# EAGLE design LatarMain (EAGLE 9.6.2)

## Sheet 1 of 2: Microcontroller
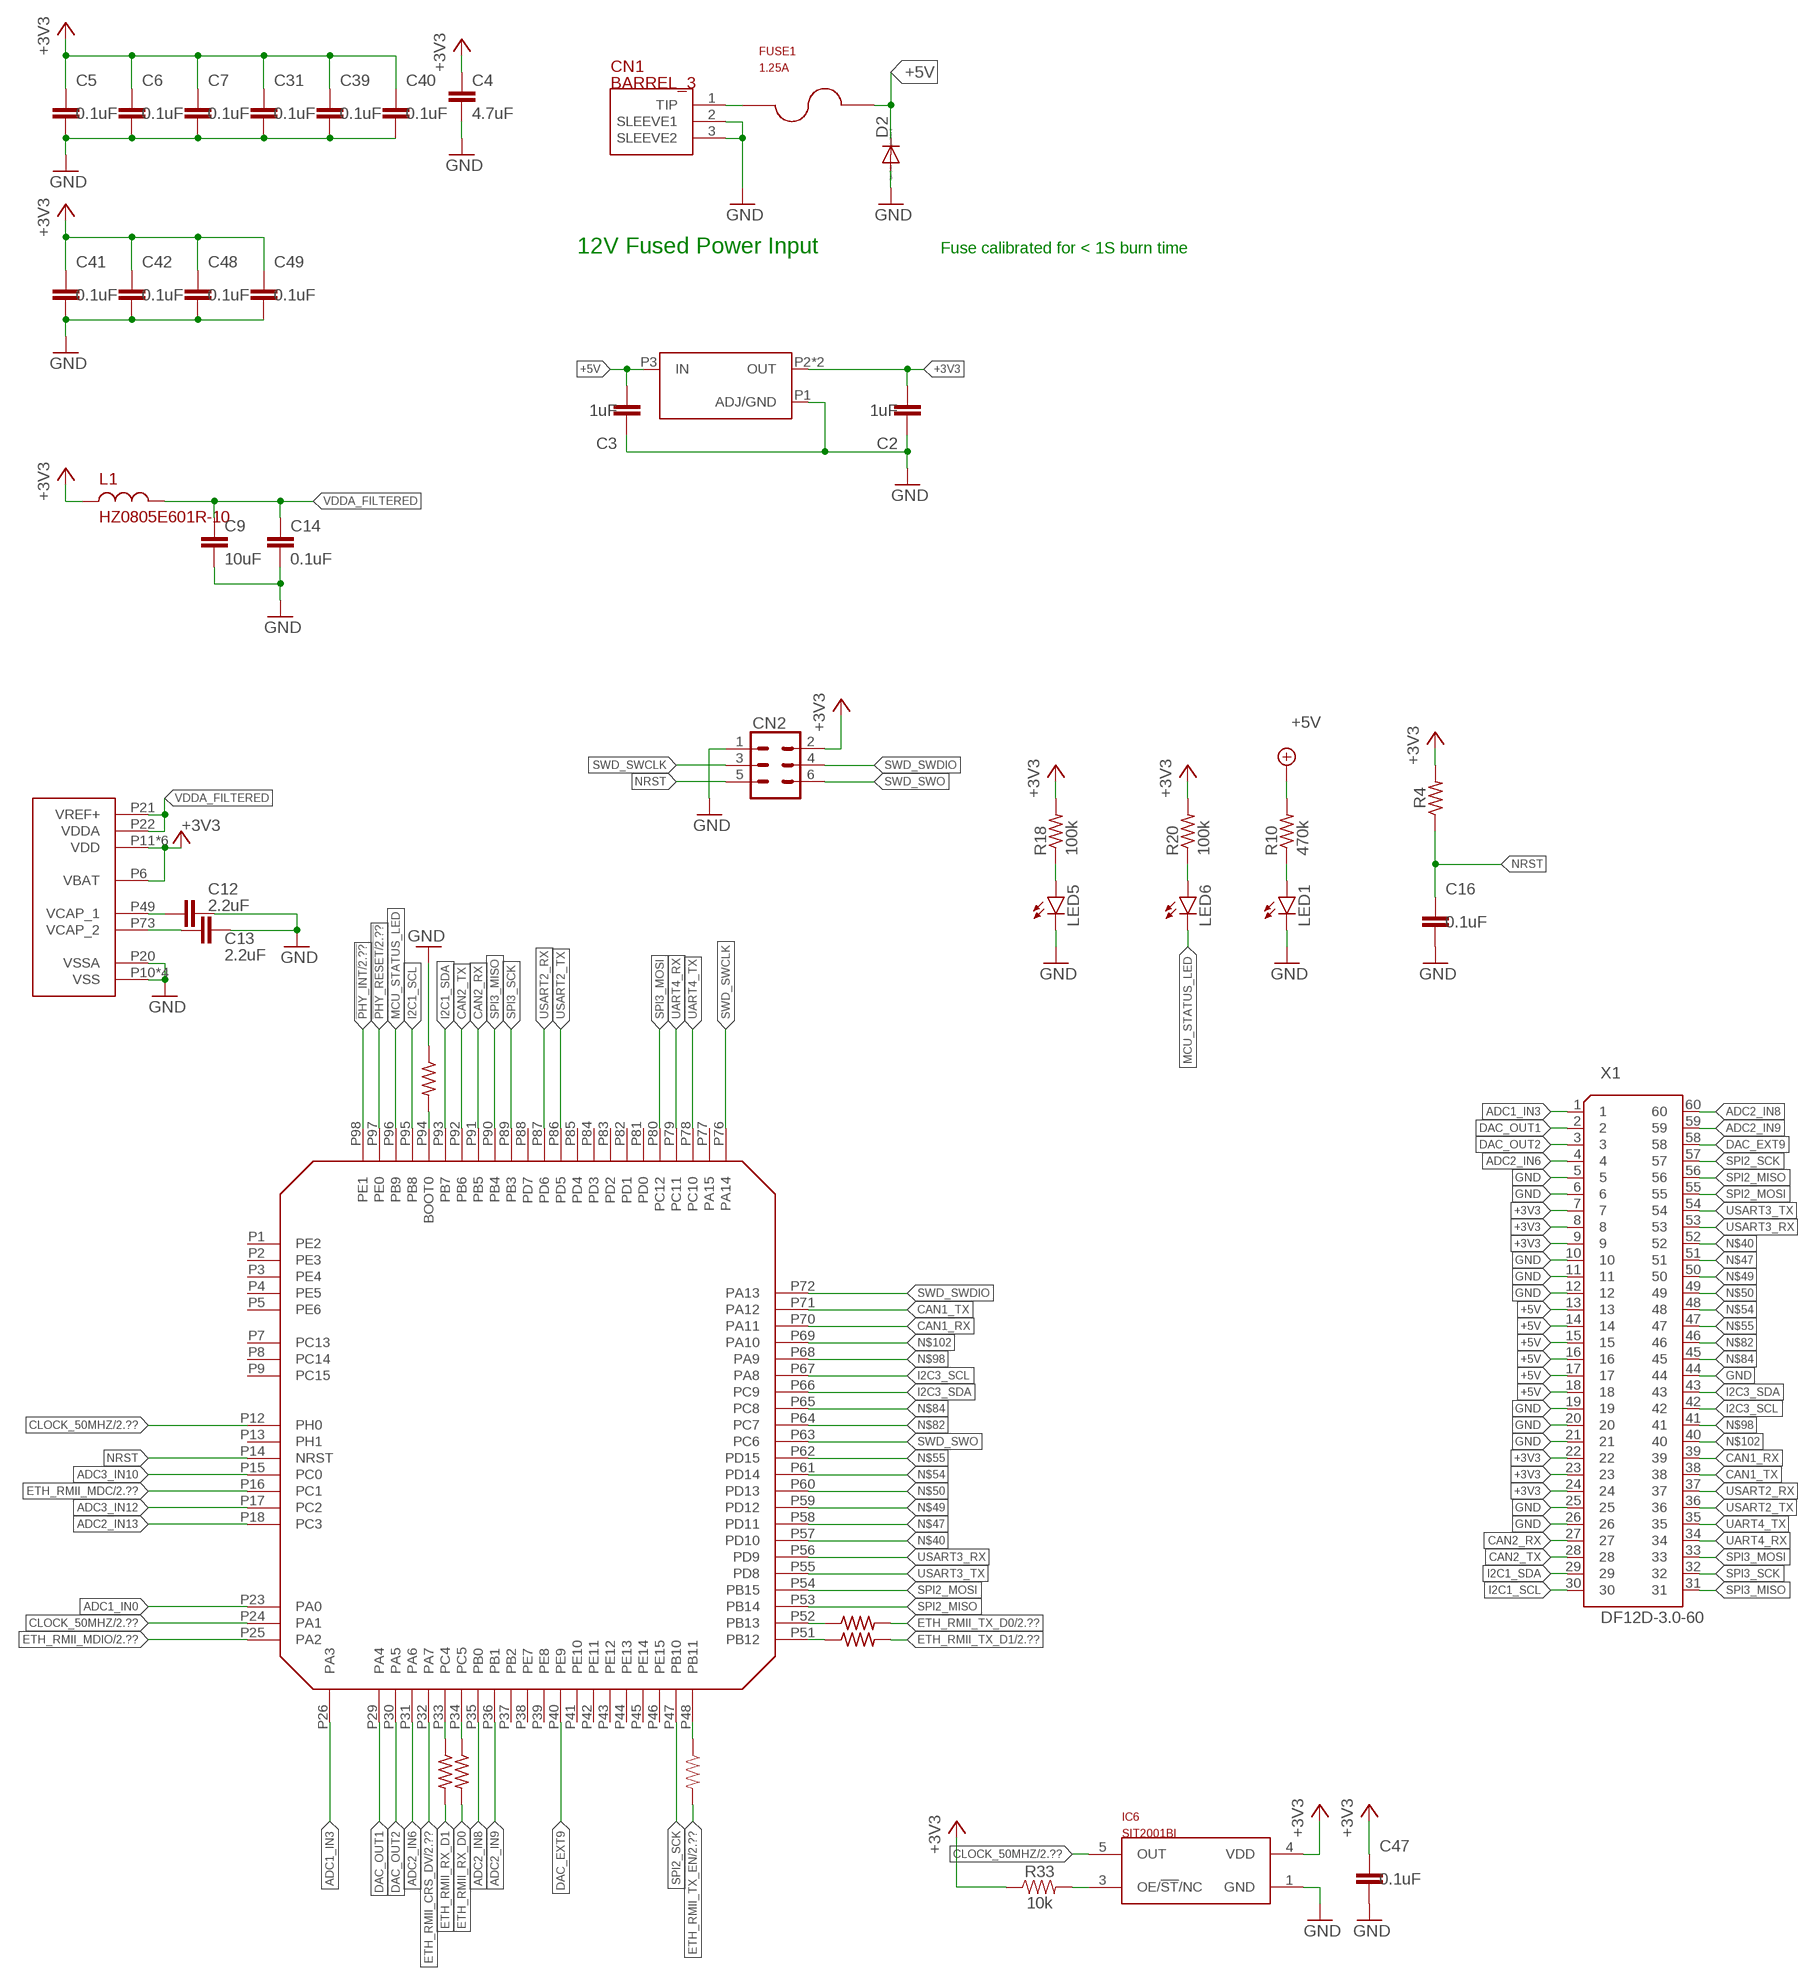
[diagram p0: schematic, sheet 1]

### Parts
C2  1uF  C-EUC1206  [C1206]
C3  1uF  C-EUC1206  [C1206]
C4  4.7uF  C-EUC0805  [C0805]
C5  0.1uF  C-EUC0603  [C0603]
C6  0.1uF  C-EUC0603  [C0603]
C7  0.1uF  C-EUC0603  [C0603]
C9  10uF  C-EUC0805  [C0805]
C12  2.2uF  C-EUC0805  [C0805]
C13  2.2uF  C-EUC0805  [C0805]
C14  0.1uF  C-EUC0805  [C0805]
C16  0.1uF  C-EUC0603  [C0603]
C31  0.1uF  C-EUC0603  [C0603]
C39  0.1uF  C-EUC0603  [C0603]
C40  0.1uF  C-EUC0603  [C0603]
C41  0.1uF  C-EUC0603  [C0603]
C42  0.1uF  C-EUC0603  [C0603]
C47  0.1uF  C-EUC0603  [C0603]
C48  0.1uF  C-EUC0603  [C0603]
C49  0.1uF  C-EUC0603  [C0603]
CN1  BARREL_3  [PJ-002AH]
CN2  CONN_03X22X3_SILK_MALE_PTH  [2X3]
D2  DIODE-DO214AC  [DO214AC]
FUSE1  1.25A  FUSE  [BEL_FUSE_2SMD]
IC6  SIT2001BI  [SOT23-5]
L1  HZ0805E601R-10  [R0805]
LED1  LEDCHIPLED_0603  [CHIPLED_0603]
LED5  LEDCHIPLED_0603  [CHIPLED_0603]
LED6  LEDCHIPLED_0603  [CHIPLED_0603]
R4  10k  R-US_R0805  [R0805]
R10  470k  R-US_R0603  [R0603]
R18  100k  R-US_R0603  [R0603]
R20  100k  R-US_R0603  [R0603]
R32  50k  R-US_R0402  [R0402]
R33  10k  RESISTOR0805  [0805]
R34  10k  R-US_R0805  [R0805]
R39  50k  R-US_R0402  [R0402]
R40  50k  R-US_R0402  [R0402]
R41  50k  R-US_R0402  [R0402]
R42  50k  RESISTOR0603  [0603]
U$1  AZ1117E  [SOT-223]
U$2  STM32_F407_LQFP100  [STM32_LQFP100]
X1  DF12D-3.0-60  [DF12-3.0-60]

### Nets
!PHY_INT: U$2.P98(PE1) ; also sheet 2
!PHY_RESET: U$2.P97(PE0) ; also sheet 2
+3V3: C2.2 C4.1 C5.1 C6.1 C7.1 C31.1 C39.1 C40.1 C41.1 C42.1 C47.1 C48.1 C49.1 CN2.2 IC6.4(VDD) L1.1 R4.2 R18.2 R20.2 R33.1 U$1.P2(OUT) U$1.TAB(OUT) U$2.P6(VBAT) U$2.P11(VDD) U$2.P19(VDD) U$2.P28(VDD) U$2.P50(VDD) U$2.P75(VDD) U$2.P100(VDD) X1.7 X1.8 X1.9 X1.22 X1.23 X1.24 ; also sheet 2
+5V: C3.2 D2.C FUSE1.2 R10.2 U$1.P3(IN) X1.13 X1.14 X1.15 X1.16 X1.17 X1.18
ADC1_IN0: U$2.P23(PA0)
ADC1_IN3: U$2.P26(PA3) X1.1
ADC2_IN6: U$2.P31(PA6) X1.4
ADC2_IN8: U$2.P35(PB0) X1.60
ADC2_IN9: U$2.P36(PB1) X1.59
ADC2_IN13: U$2.P18(PC3)
ADC3_IN10: U$2.P15(PC0)
ADC3_IN12: U$2.P17(PC2)
CAN1_RX: U$2.P70(PA11) X1.39
CAN1_TX: U$2.P71(PA12) X1.38
CAN2_RX: U$2.P91(PB5) X1.27
CAN2_TX: U$2.P92(PB6) X1.28
CLOCK_50MHZ: IC6.5(OUT) U$2.P12(PH0) U$2.P24(PA1) ; also sheet 2
DAC_EXT9: U$2.P40(PE9) X1.58
DAC_OUT1: U$2.P29(PA4) X1.2
DAC_OUT2: U$2.P30(PA5) X1.3
ETH_RMII_CRS_DV: U$2.P32(PA7) ; also sheet 2
ETH_RMII_MDC: U$2.P16(PC1) ; also sheet 2
ETH_RMII_MDIO: U$2.P25(PA2) ; also sheet 2
ETH_RMII_RX_D0: R32.2
ETH_RMII_RX_D1: R39.2
ETH_RMII_TX_D0: R40.2 ; also sheet 2
ETH_RMII_TX_D1: R41.2 ; also sheet 2
ETH_RMII_TX_EN: R42.2 ; also sheet 2
GND: C2.1 C3.1 C4.2 C5.2 C6.2 C7.2 C9.2 C12.2 C13.2 C14.2 C16.2 C31.2 C39.2 C40.2 C41.2 C42.2 C47.2 C48.2 C49.2 CN1.2(SLEEVE1) CN1.3(SLEEVE2) CN2.1 D2.A IC6.1(GND) LED1.C LED5.C R34.1 U$1.P1(ADJ/GND) U$2.P10(VSS) U$2.P20(VSSA) U$2.P27(VSS) U$2.P74(VSS) U$2.P99(VSS) X1.5 X1.6 X1.10 X1.11 X1.12 X1.19 X1.20 X1.21 X1.25 X1.26 X1.44 ; also sheet 2
I2C1_SCL: U$2.P95(PB8) X1.30
I2C1_SDA: U$2.P93(PB7) X1.29
I2C3_SCL: U$2.P67(PA8) X1.42
I2C3_SDA: U$2.P66(PC9) X1.43
MCU_STATUS_LED: LED6.C U$2.P96(PB9)
N$4: R39.1 U$2.P33(PC4)
N$9: C12.1 U$2.P49(VCAP_1)
N$11: C13.1 U$2.P73(VCAP_2)
N$13: R40.1 U$2.P52(PB13)
N$15: LED1.A R10.1
N$18: R34.2 U$2.P94(BOOT0)
N$25: IC6.3(OE/!ST!/NC) R33.2
N$29: CN1.1(TIP) FUSE1.1
N$37: R32.1 U$2.P34(PC5)
N$38: R41.1 U$2.P51(PB12)
N$39: R42.1 U$2.P48(PB11)
N$40: U$2.P57(PD10) X1.52
N$47: U$2.P58(PD11) X1.51
N$48: LED6.A R20.1
N$49: U$2.P59(PD12) X1.50
N$50: U$2.P60(PD13) X1.49
N$54: U$2.P61(PD14) X1.48
N$55: U$2.P62(PD15) X1.47
N$82: U$2.P64(PC7) X1.46
N$84: U$2.P65(PC8) X1.45
N$98: U$2.P68(PA9) X1.41
N$102: U$2.P69(PA10) X1.40
N$104: LED5.A R18.1
NRST: C16.1 CN2.5 R4.1 U$2.P14(NRST)
SPI2_MISO: U$2.P53(PB14) X1.56
SPI2_MOSI: U$2.P54(PB15) X1.55
SPI2_SCK: U$2.P47(PB10) X1.57
SPI3_MISO: U$2.P90(PB4) X1.31
SPI3_MOSI: U$2.P80(PC12) X1.33
SPI3_SCK: U$2.P89(PB3) X1.32
SWD_SWCLK: CN2.3 U$2.P76(PA14)
SWD_SWDIO: CN2.4 U$2.P72(PA13)
SWD_SWO: CN2.6 U$2.P63(PC6)
UART4_RX: U$2.P79(PC11) X1.34
UART4_TX: U$2.P78(PC10) X1.35
USART2_RX: U$2.P87(PD6) X1.37
USART2_TX: U$2.P86(PD5) X1.36
USART3_RX: U$2.P56(PD9) X1.53
USART3_TX: U$2.P55(PD8) X1.54
VDDA_FILTERED: C9.1 C14.1 L1.2 U$2.P21(VREF+) U$2.P22(VDDA)
Unconnected: U$2.P1(PE2) U$2.P2(PE3) U$2.P3(PE4) U$2.P4(PE5) U$2.P5(PE6) U$2.P7(PC13) U$2.P8(PC14) U$2.P9(PC15) U$2.P13(PH1) U$2.P37(PB2) U$2.P38(PE7) U$2.P39(PE8) U$2.P41(PE10) U$2.P42(PE11) U$2.P43(PE12) U$2.P44(PE13) U$2.P45(PE14) U$2.P46(PE15) U$2.P77(PA15) U$2.P81(PD0) U$2.P82(PD1) U$2.P83(PD2) U$2.P84(PD3) U$2.P85(PD4) U$2.P88(PD7)

### Notes on the sheet
- 12V Fused Power Input | Fuse calibrated for < 1S burn time

## Sheet 2 of 2: Ethernet
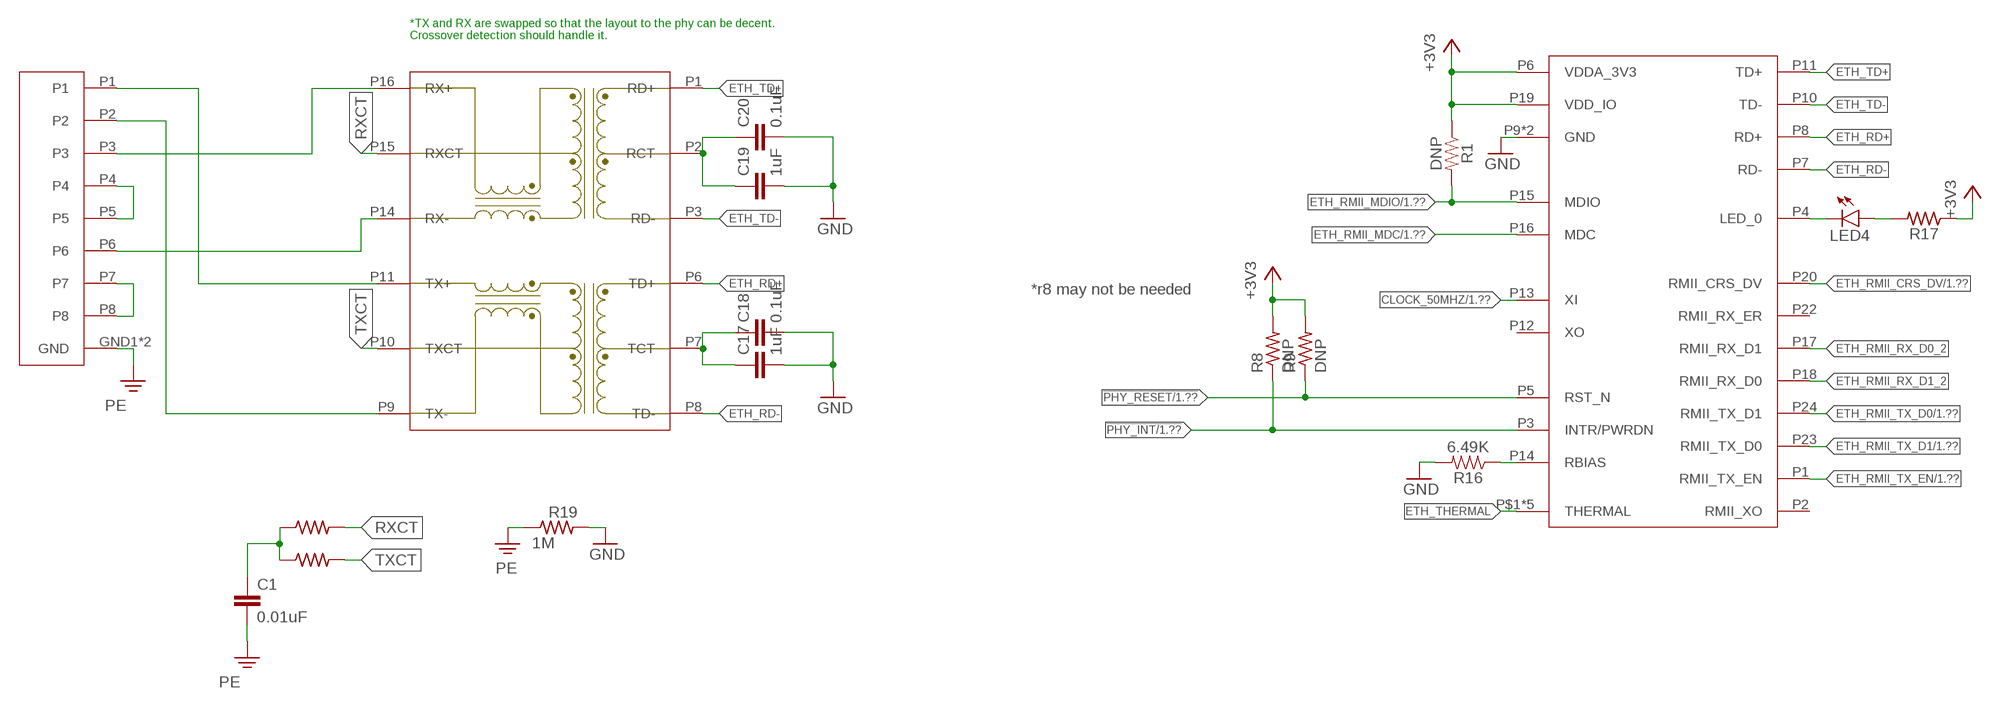
[diagram p1: schematic, sheet 2]

### Parts
C1  0.01uF  C-EUC0805  [C0805]
C17  1uF  C-EUC0805  [C0805]
C18  0.1uF  C-EUC0805  [C0805]
C19  1uF  C-EUC0805  [C0805]
C20  0.1uF  C-EUC0805  [C0805]
LED4  LEDCHIP-LED0603  [CHIP-LED0603]
R1  DNP  RESISTOR0603  [0603]
R2  75R  R-US_R0805  [R0805]
R5  75R  R-US_R0805  [R0805]
R8  DNP  R-US_R0603  [R0603]
R9  DNP  R-US_R0603  [R0603]
R16  6.49K  RESISTOR0603  [0603]
R17  100k  R-US_R0603  [R0603]
R19  1M  R-US_R1206  [R1206]
U$15  749013011  [749013011]
U$16  A120645-ND  [A120645-ND]
U$17  DP83825I  [DP83825I]

### Nets
!PHY_INT: R8.1 U$17.P3(INTR/PWRDN) ; also sheet 1
!PHY_RESET: R9.1 U$17.P5(RST_N) ; also sheet 1
+3V3: R1.1 R8.2 R9.2 R17.1 U$17.P6(VDDA_3V3) U$17.P19(VDD_IO) ; also sheet 1
CLOCK_50MHZ: U$17.P13(XI) ; also sheet 1
ETH_RD+: U$15.P6(TD+) U$17.P8(RD+)
ETH_RD-: U$15.P8(TD-) U$17.P7(RD-)
ETH_RMII_CRS_DV: U$17.P20(RMII_CRS_DV) ; also sheet 1
ETH_RMII_MDC: U$17.P16(MDC) ; also sheet 1
ETH_RMII_MDIO: R1.2 U$17.P15(MDIO) ; also sheet 1
ETH_RMII_RX_D0_2: U$17.P17(RMII_RX_D1)
ETH_RMII_RX_D1_2: U$17.P18(RMII_RX_D0)
ETH_RMII_TX_D0: U$17.P24(RMII_TX_D1) ; also sheet 1
ETH_RMII_TX_D1: U$17.P23(RMII_TX_D0) ; also sheet 1
ETH_RMII_TX_EN: U$17.P1(RMII_TX_EN) ; also sheet 1
ETH_TD+: U$15.P1(RD+) U$17.P11(TD+)
ETH_TD-: U$15.P3(RD-) U$17.P10(TD-)
ETH_THERMAL: U$17.P$1(THERMAL) U$17.P$2(THERMAL) U$17.P$3(THERMAL) U$17.P$4(THERMAL) U$17.PT(THERMAL)
GND: C17.2 C18.2 C19.2 C20.2 R16.2 R19.2 U$17.P9(GND) U$17.P21(GND) ; also sheet 1
GND_EARTH: C1.2 R19.1 U$16.GND1(GND) U$16.GND2(GND) ; supply symbol labelled PE
N$2: LED4.C U$17.P4(LED_0)
N$7: C19.1 C20.1 U$15.P2(RCT)
N$8: C17.1 C18.1 U$15.P7(TCT)
N$10: C1.1 R2.1 R5.1
N$14: U$15.P14(RX-) U$16.P6
N$16: U$15.P9(TX-) U$16.P2
N$23: U$15.P11(TX+) U$16.P1
N$43: U$15.P16(RX+) U$16.P3
N$44: U$16.P4 U$16.P5
N$45: U$16.P7 U$16.P8
N$46: LED4.A R17.2
N$60: R16.1 U$17.P14(RBIAS)
RXCT: R2.2 U$15.P15(RXCT)
TXCT: R5.2 U$15.P10(TXCT)
Unconnected: U$17.P2(RMII_XO) U$17.P12(XO) U$17.P22(RMII_RX_ER)

### Notes on the sheet
- *TX and RX are swapped so that the layout to the phy can be decent.
  Crossover detection should handle it.
- *r8 may not be needed

## Library data of the parts
C1-C7 C9 C12-C14 C16-C20 C31 C39-C42 C47-C49 = rcl:C-EU: CAPACITOR, European symbol; SPICEPREFIX: C
CN1 = HappyMedium:BARREL_3
CN2 = SparkFun-Connectors:CONN_03X2: Multi connection point. Often used as Generic Header-pin footprint for 0.1 inch spaced/style header connections You can populate with any combo of single row headers, but if you'd like an exact match, check these: Header - 2x3 (Male, 0.1") <https://www.sparkfun.com/products/12807> (PRT-12807) Header - 2x3 (Female, 0.1") <https://www.sparkfun.com/products/13010> (PRT-13010) 2x3 Pin Shrouded Header <https://www.sparkfun.com/products/10877> (PRT-10877) On any of the 0.1 inch spaced packages, you can populate with these: Break Away Headers - Straight <https://www.sparkfun.com/products/116> (PRT-00116) Break Away Male Headers - Right Angle <https://www.sparkfun.com/products/553> (PRT-00553) Female Headers <https://www.sparkfun.com/products/115> (PRT-00115) Break Away Headers - Machine Pin <https://www.sparkfun.com/products/117> (PRT-00117) Break Away Female Headers - Swiss Machine Pin <https://www.sparkfun.com/products/743> (PRT-00743) Special note: the shrouded connector mates well with our 3x2 ribbon cables: Ribbon Crimp Connector - 6-pin (2x3, Female) <https://www.sparkfun.com/products/10651> (PRT-10651) Ribbon Cable - 6 wire (15ft) <https://www.sparkfun.com/products/10646> (PRT-10646); PROD_ID: CONN-09701
D2 = diode:DIODE-: DIODE
FUSE1 = HappyMedium:FUSE
IC6 = HappyMedium:SIT2001BI
L1 = HappyMedium:HZ0805E601R-10
LED1 LED4-LED6 = led:LED: LED OSRAM: - CHIPLED LG R971, LG N971, LY N971, LG Q971, LY Q971, LO R971, LY R971 LH N974, LH R974 LS Q976, LO Q976, LY Q976 LO Q996 - Hyper CHIPLED LW Q18S LB Q993, LB Q99A, LB R99A - SideLED LS A670, LO A670, LY A670, LG A670, LP A670 LB A673, LV A673, LT A673, LW A673 LH A674 LY A675 LS A676, LA A676, LO A676, LY A676, LW A676 LS A679, LY A679, LG A679 - Hyper Micro SIDELED® LS Y876, LA Y876, LO Y876, LY Y876 LT Y87S - SmartLED LW L88C, LW L88S LB L89C, LB L89S, LG L890 LS L89K, LO L89K, LY L89K LS L896, LA L896, LO L896, LY L896 - TOPLED LS T670, LO T670, LY T670, LG T670, LP T670 LSG T670, LSP T670, LSY T670, LOP T670, LYG T670 LG T671, LOG T671, LSG T671 LB T673, LV T673, LT T673, LW T673 LH T674 LS T676, LA T676, LO T676, LY T676, LB T676, LH T676, LSB T676, LW T676 LB T67C, LV T67C, LT T67C, LS T67K, LO T67K, LY T67K, LW E67C LS E67B, LA E67B, LO E67B, LY E67B, LB E67C, LV E67C, LT E67C LW T67C LS T679, LY T679, LG T679 LS T770, LO T770, LY T770, LG T770, LP T770 LB T773, LV T773, LT T773, LW T773 LH T774 LS E675, LA E675, LY E675, LS T675 LS T776, LA T776, LO T776, LY T776, LB T776 LHGB T686 LT T68C, LB T68C - Hyper Mini TOPLED® LB M676 - Mini TOPLED Santana® LG M470 LS M47K, LO M47K, LY M47K Source: http://www.osram.convergy.de LUXEON: - LUMILED® LXK2-PW12-R00, LXK2-PW12-S00, LXK2-PW14-U00, LXK2-PW14-V00 LXK2-PM12-R00, LXK2-PM12-S00, LXK2-PM14-U00 LXK2-PE12-Q00, LXK2-PE12-R00, LXK2-PE12-S00, LXK2-PE14-T00, LXK2-PE14-U00 LXK2-PB12-K00, LXK2-PB12-L00, LXK2-PB12-M00, LXK2-PB14-N00, LXK2-PB14-P00, LXK2-PB14-Q00 LXK2-PR12-L00, LXK2-PR12-M00, LXK2-PR14-Q00, LXK2-PR14-R00 LXK2-PD12-Q00, LXK2-PD12-R00, LXK2-PD12-S00 LXK2-PH12-R00, LXK2-PH12-S00 LXK2-PL12-P00, LXK2-PL12-Q00, LXK2-PL12-R00 Source: www.luxeon.com KINGBRIGHT: KA-3528ASYC Source: www.kingbright.com
R1 R16 R33 R42 = SparkFun-Resistors:RESISTOR: Generic Resistor Package
R2 R4 R5 R8-R10 R17-R20 R32 R34 R39-R41 = rcl:R-US_: RESISTOR, American symbol; SPICEPREFIX: R
U$1 = poe:AZ1117E
U$2 = poe:STM32_F407_LQFP100
U$15 = poe:749013011
U$16 = poe:A120645-ND
U$17 = poe:DP83825I
X1 = con-hirose:DF12D-3.0-60: 60 pin connector PN: DF12D(3.0)-60DP-0.5V Source: con-hirose-df12d(3.0)60dp0.5v80.lbr from Bob Starr <rtzaudio@mindspring.com>; OC_FARNELL: unknown; OC_NEWARK: unknown

## Board
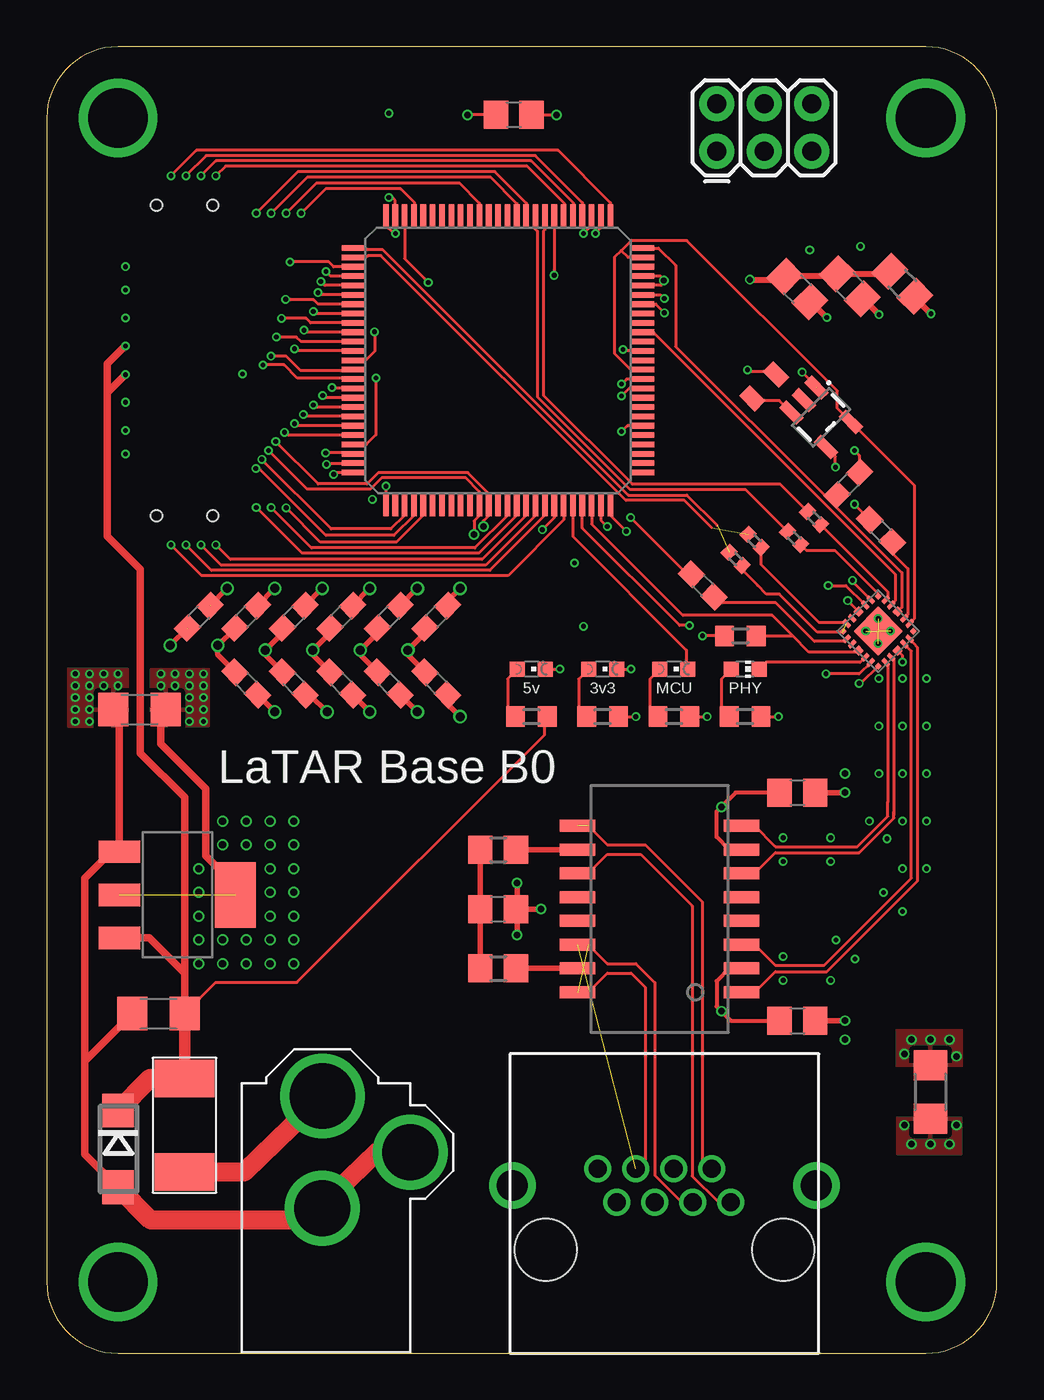
[diagram p2: board, top side]
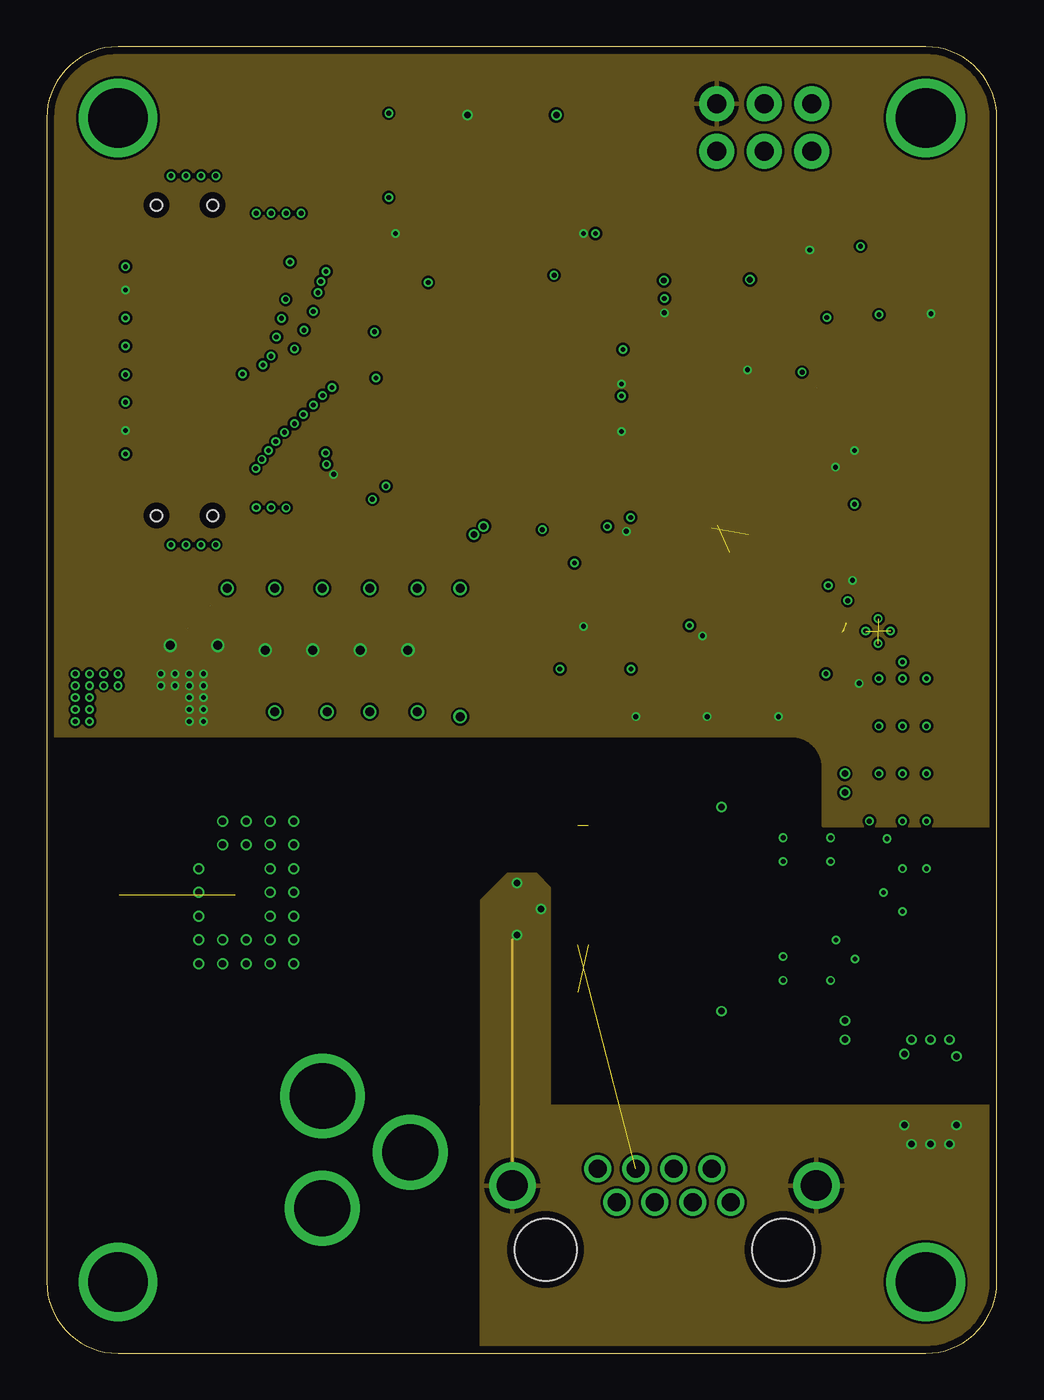
[diagram p3: board, inner layer Route2]
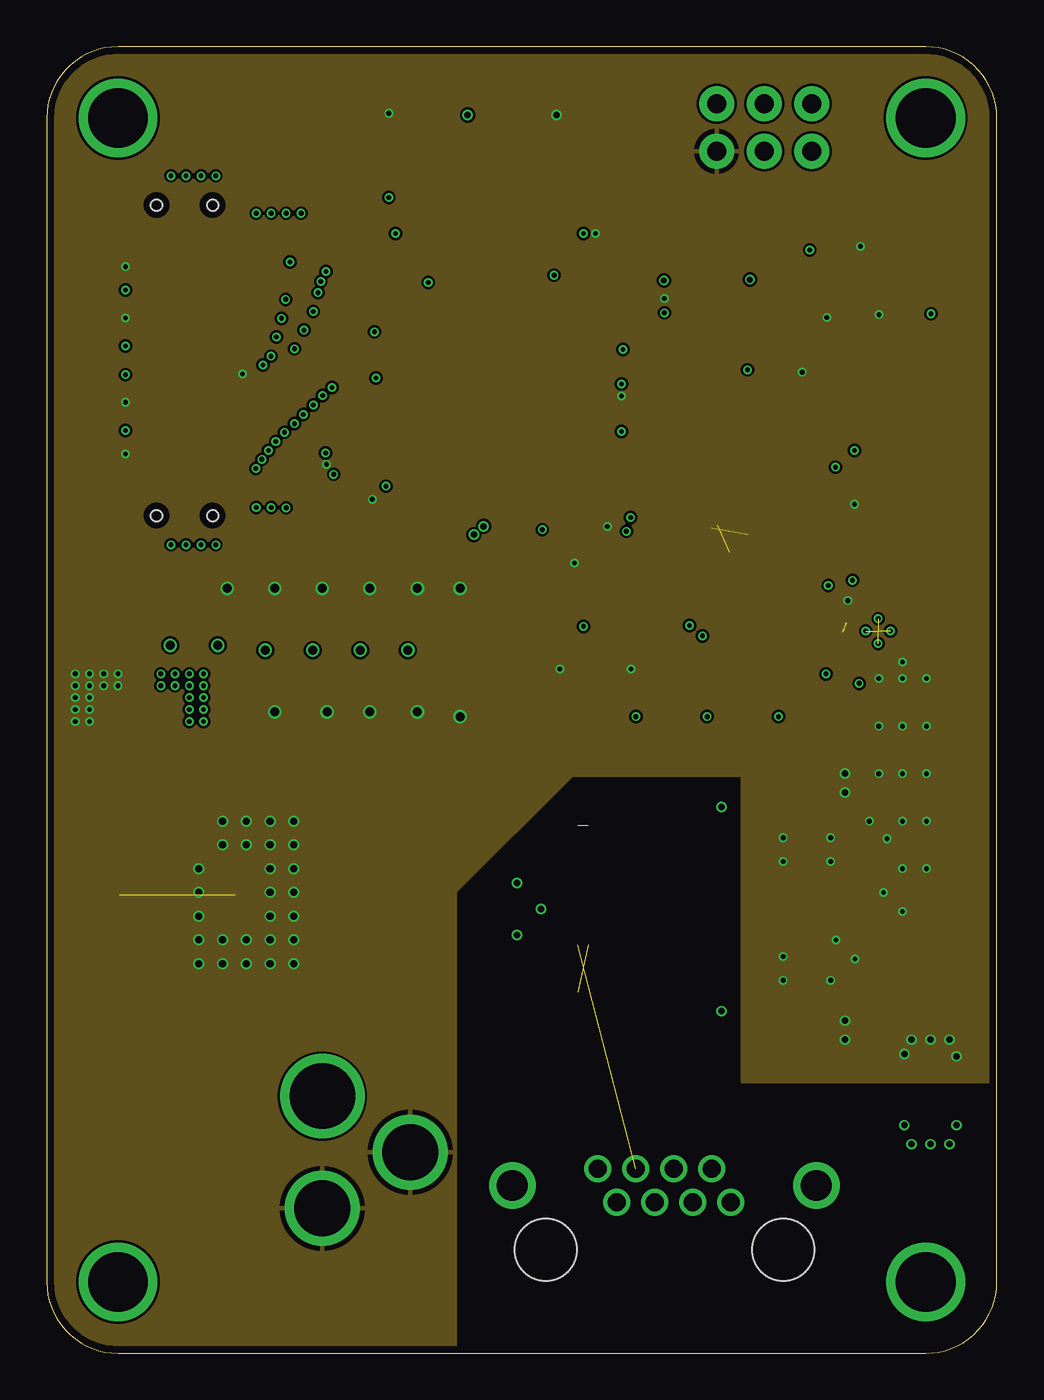
[diagram p4: board, inner layer Route15]
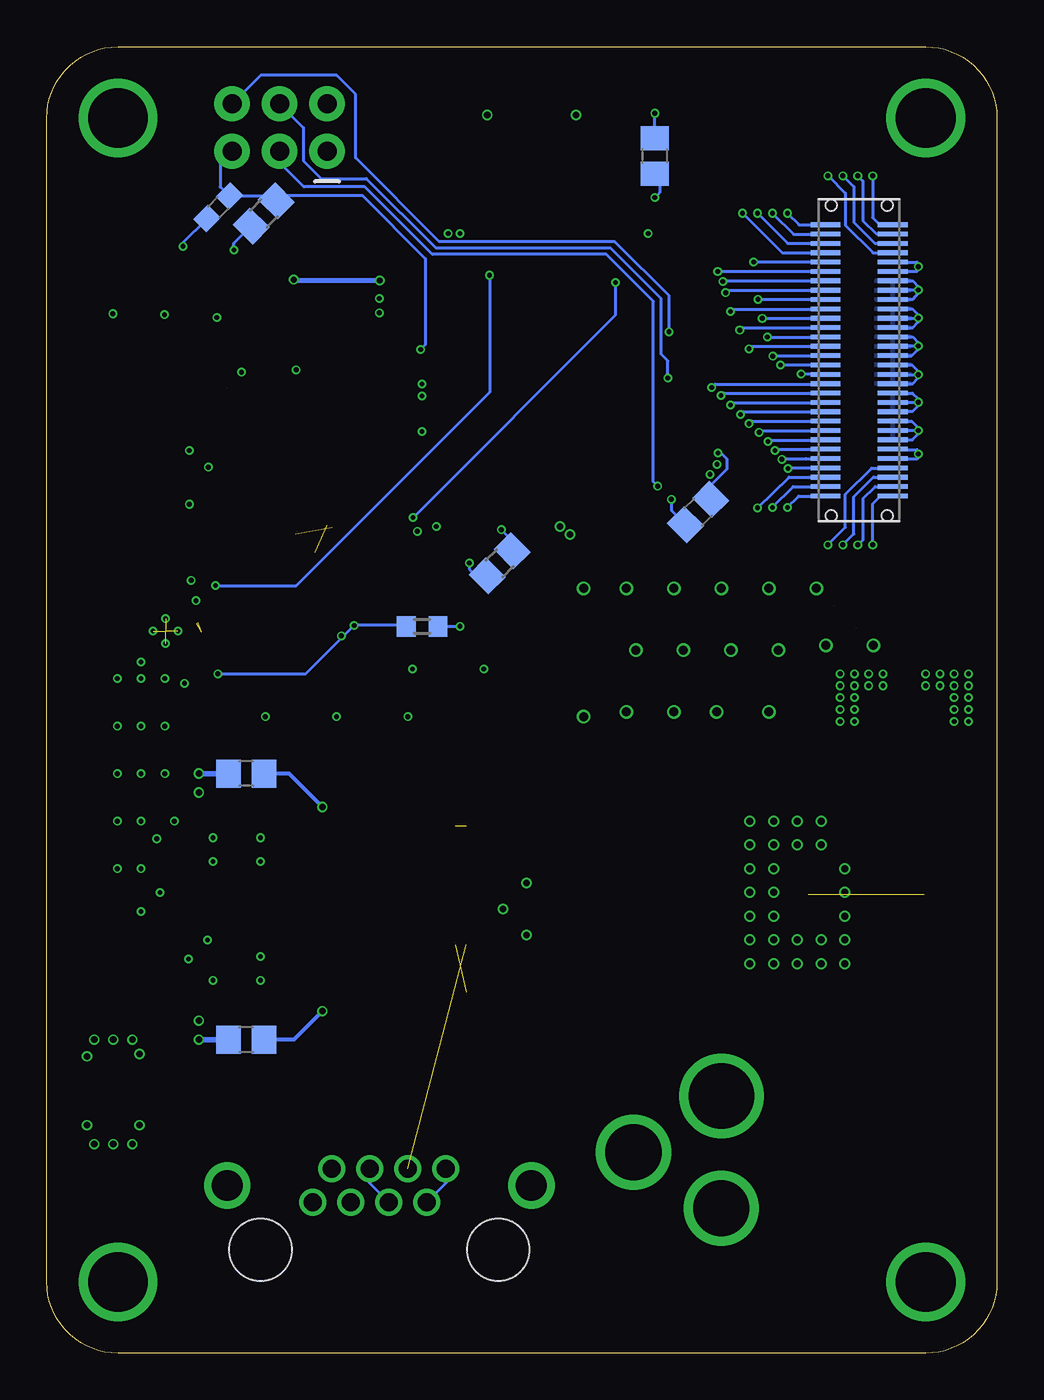
[diagram p5: board, bottom side, seen from below]

Size 50.8 x 69.85 mm. Coordinates in mm from the lower left corner, seen from the top.
Outline: 50.8,3.81 50.8,66.04 arc90 46.99,69.85 3.81,69.85 arc90 0,66.04 0,3.81 arc90 3.81,0 46.99,0 arc90 50.8,3.81
Copper layers (1*2*15*16): Top 0.035559375mm / dielectric 0.17018125mm / Route2 0.01778125mm / dielectric 47mil / Route15 0.01778125mm / dielectric 0.17018125mm / Bottom 0.035559375mm
Design rules "oshpark-4layer": minimum track width 5mil, minimum drill 10mil, track to track 5mil, track to pad 5mil, pad to pad 5mil, via to via 5mil, smd to smd 5mil, copper to edge 15mil, drill to drill 6mil, minimum pad ring 4mil, minimum via ring 4mil, stop-mask expansion 2.5mil, vias tented up to drill 0mil, thermal gap 10mil

### Footprints (pad centres in the part's own frame; a part is rotated, then mirrored left to right if it is on the bottom)
C0805 = smd 1.3 x 1.5: 1 -0.95,0; 2 0.95,0
C1206 = smd 1.6 x 1.8: 1 -1.4,0; 2 1.4,0
C0603 = smd 1.1 x 1: 1 -0.85,0; 2 0.85,0
PJ-002AH = drill 3.5: 1 0,6 | drill 3: 2 0,0; 3 4.7,3
2X3 = drill 1.016 pad 1.88: 1 0,0; 2 0,2.54; 3 2.54,0; 4 2.54,2.54; 5 5.08,0; 6 5.08,2.54
DO214AC = smd 1.8 x 1.7: A 2.05,0; C -2.05,0
BEL_FUSE_2SMD = smd 3.18 x 2: 1 0,-2.5; 2 0,2.5
SOT23-5 = smd 0.55 x 1.3: 1 -0.95,-1.3; 2 0,-1.3; 3 0.95,-1.3; 4 0.95,1.3; 5 -0.95,1.3
R0805 = smd 1.3 x 1.5: 1 -0.95,0; 2 0.95,0
CHIPLED_0603 = smd 0.8 x 0.8: A 0,-0.75; C 0,0.75
CHIP-LED0603 = smd 0.8 x 0.8: A 0,-0.75; C 0,0.75
0603 = smd 1.1 x 1: 1 -0.85,0; 2 0.85,0
R0603 = smd 1 x 1.1: 1 -0.85,0; 2 0.85,0
R1206 = smd 1.6 x 1.803: 1 -1.422,0; 2 1.422,0
R0402 = smd 0.6 x 0.7: 1 -0.5,0; 2 0.5,0
0805 = smd 0.8 x 1.2: 1 -0.9,0; 2 0.9,0
SOT-223 = smd 1.2 x 2.2: P1 -2.3,-3.1; P2 0,-3.1; P3 2.3,-3.1 | smd 3.5 x 2.2: TAB 0,3.1
STM32_LQFP100 = smd 0.3 x 1.2: P1 -6,-7.75; P2 -5.5,-7.75; P3 -5,-7.75; P4 -4.5,-7.75; P5 -4,-7.75; P6 -3.5,-7.75; P7 -3,-7.75; P8 -2.5,-7.75; P9 -2,-7.75; P10 -1.5,-7.75; P11 -1,-7.75; P12 -0.5,-7.75; P13 0,-7.75; P14 0.5,-7.75; P15 1,-7.75; P16 1.5,-7.75; P17 2,-7.75; P18 2.5,-7.75; P19 3,-7.75; P20 3.5,-7.75; P21 4,-7.75; P22 4.5,-7.75; P23 5,-7.75; P24 5.5,-7.75; P25 6,-7.75; P51 6,7.75; P52 5.5,7.75; P53 5,7.75; P54 4.5,7.75; P55 4,7.75; P56 3.5,7.75; P57 3,7.75; P58 2.5,7.75; P59 2,7.75; P60 1.5,7.75; P61 1,7.75; P62 0.5,7.75; P63 0,7.75; P64 -0.5,7.75; P65 -1,7.75; P66 -1.5,7.75; P67 -2,7.75; P68 -2.5,7.75; P69 -3,7.75; P70 -3.5,7.75; P71 -4,7.75; P72 -4.5,7.75; P73 -5,7.75; P74 -5.5,7.75; P75 -6,7.75 | smd 1.2 x 0.3: P26 7.75,-6; P27 7.75,-5.5; P28 7.75,-5; P29 7.75,-4.5; P30 7.75,-4; P31 7.75,-3.5; P32 7.75,-3; P33 7.75,-2.5; P34 7.75,-2; P35 7.75,-1.5; P36 7.75,-1; P37 7.75,-0.5; P38 7.75,0; P39 7.75,0.5; P40 7.75,1; P41 7.75,1.5; P42 7.75,2; P43 7.75,2.5; P44 7.75,3; P45 7.75,3.5; P46 7.75,4; P47 7.75,4.5; P48 7.75,5; P49 7.75,5.5; P50 7.75,6; P76 -7.75,6; P77 -7.75,5.5; P78 -7.75,5; P79 -7.75,4.5; P80 -7.75,4; P81 -7.75,3.5; P82 -7.75,3; P83 -7.75,2.5; P84 -7.75,2; P85 -7.75,1.5; P86 -7.75,1; P87 -7.75,0.5; P88 -7.75,0; P89 -7.75,-0.5; P90 -7.75,-1; P91 -7.75,-1.5; P92 -7.75,-2; P93 -7.75,-2.5; P94 -7.75,-3; P95 -7.75,-3.5; P96 -7.75,-4; P97 -7.75,-4.5; P98 -7.75,-5; P99 -7.75,-5.5; P100 -7.75,-6
749013011 = smd 0.64 x 1.91: P1 -4.445,-4.385; P2 -3.175,-4.385; P3 -1.905,-4.385; P4 -0.635,-4.385; P5 0.635,-4.385; P6 1.905,-4.385; P7 3.175,-4.385; P8 4.445,-4.385; P9 4.445,4.385; P10 3.175,4.385; P11 1.905,4.385; P12 0.635,4.385; P13 -0.635,4.385; P14 -1.905,4.385; P15 -3.175,4.385; P16 -4.445,4.385
A120645-ND = drill 1.651: GND1 -8.128,8.966; GND2 8.128,8.966 | drill 0.965: P1 3.556,8.077; P2 2.54,9.855; P3 1.524,8.077; P4 0.508,9.855; P5 -0.508,8.077; P6 -1.524,9.855; P7 -2.54,8.077; P8 -3.556,9.855 | hole 3.327: -6.35,5.537; 6.35,5.537
DP83825I = smd 0.45 x 0.2: P1 -1.475,0.9; P2 -1.475,0.5; P4 -1.475,-0.5; P5 -1.475,-0.9; P13 1.475,-0.9; P14 1.475,-0.5; P16 1.475,0.5; P17 1.475,0.9 | smd 0.4 x 0.4: P3 -1.475,0; P9 0,-1.475; P15 1.475,0; P21 0,1.475 | smd 0.25 x 0.25: P6 -1.325,-1.325; P12 1.325,-1.325; P18 1.325,1.325; P24 -1.325,1.325 | smd 0.2 x 0.45: P7 -0.9,-1.475; P8 -0.5,-1.475; P10 0.5,-1.475; P11 0.9,-1.475; P19 0.9,1.475; P20 0.5,1.475; P22 -0.5,1.475; P23 -0.9,1.475 | drill 0.254: P$1 0.47,-0.47; P$2 0.47,0.47; P$3 -0.47,0.47; P$4 -0.47,-0.47 | smd 1.9 x 1.9: PT 0,0
DF12-3.0-60 = smd 1.6 x 0.25: 1 1.8,7.25; 2 1.8,6.75; 3 1.8,6.25; 4 1.8,5.75; 5 1.8,5.25; 6 1.8,4.75; 7 1.8,4.25; 8 1.8,3.75; 9 1.8,3.25; 10 1.8,2.75; 11 1.8,2.25; 12 1.8,1.75; 13 1.8,1.25; 14 1.8,0.75; 15 1.8,0.25; 16 1.8,-0.25; 17 1.8,-0.75; 18 1.8,-1.25; 19 1.8,-1.75; 20 1.8,-2.25; 21 1.8,-2.75; 22 1.8,-3.25; 23 1.8,-3.75; 24 1.8,-4.25; 25 1.8,-4.75; 26 1.8,-5.25; 27 1.8,-5.75; 28 1.8,-6.25; 29 1.8,-6.75; 30 1.8,-7.25; 31 -1.8,-7.25; 32 -1.8,-6.75; 33 -1.8,-6.25; 34 -1.8,-5.75; 35 -1.8,-5.25; 36 -1.8,-4.75; 37 -1.8,-4.25; 38 -1.8,-3.75; 39 -1.8,-3.25; 40 -1.8,-2.75; 41 -1.8,-2.25; 42 -1.8,-1.75; 43 -1.8,-1.25; 44 -1.8,-0.75; 45 -1.8,-0.25; 46 -1.8,0.25; 47 -1.8,0.75; 48 -1.8,1.25; 49 -1.8,1.75; 50 -1.8,2.25; 51 -1.8,2.75; 52 -1.8,3.25; 53 -1.8,3.75; 54 -1.8,4.25; 55 -1.8,4.75; 56 -1.8,5.25; 57 -1.8,5.75; 58 -1.8,6.25; 59 -1.8,6.75; 60 -1.8,7.25 | hole 0.6: -1.5,8.3; 1.5,8.3; 1.5,-8.3; -1.5,-8.3

### Placement (x,y rotation side)
C1  24.13,23.75 0 top
C2  4.95,34.42 0 top
C3  5.97,18.16 0 top
C4  24.97,66.22 0 top
C5  8.13,39.37 45 top
C6  10.67,35.81 315 top
C7  20.83,35.81 315 top
C9  40.13,56.9 315 top
C12  18.29,64.01 90 bottom
C13  15.98,44.97 225 bottom
C14  42.93,57.05 315 top
C16  41.63,61.26 225 bottom
C17  40.13,30.99 180 bottom
C18  40.13,29.97 0 top
C19  40.13,16.76 180 bottom
C20  40.13,17.78 0 top
C31  18.29,35.81 315 top
C39  15.75,35.81 315 top
C40  13.21,35.81 315 top
C41  10.67,39.37 45 top
C42  13.21,39.37 45 top
C47  20.83,39.37 45 top
C48  15.75,39.37 45 top
C49  18.29,39.37 45 top
CN1  14.73,7.75 0 top
CN2  35.81,64.26 0 top
D2  3.81,10.92 270 top
FUSE1  7.37,12.19 0 top
IC6  41.4,50.04 225 top
L1  45.75,57.18 135 top
LED1  25.91,36.58 270 top
LED4  37.34,36.58 270 top
LED5  29.72,36.58 270 top
LED6  33.53,36.58 270 top
R1  42.85,46.48 225 top
R2  24.13,20.57 0 top
R4  39.19,60.93 225 bottom
R5  24.13,26.92 0 top
R8  37.08,38.35 180 top
R9  30.73,38.86 0 bottom
R10  25.91,34.04 0 top
R16  44.6,43.97 135 top
R17  37.34,34.04 180 top
R18  29.72,34.04 0 top
R19  47.24,13.97 90 top
R20  33.53,34.04 0 top
R32  39.95,43.59 315 top
R33  38.35,51.69 225 top
R34  26.59,42.23 45 bottom
R39  41.02,44.65 315 top
R40  37.85,43.43 315 top
R41  36.83,42.47 315 top
R42  35.08,41.05 315 top
U$1  6.99,24.51 270 top
U$2  24.13,53.09 90 top
U$15  32.77,23.75 90 top
U$16  33.02,0 0 top
U$17  44.45,38.61 45 top
X1  7.37,53.09 0 bottom

### Tracks (layer width: path | path; a pad name or v marks a point on that pad's centre or on a via)
!PHY_INT
  Top 0.152: U$17.P3 43.33,37.49 40.74,37.49 39.88,38.35 | 39.88,38.35 38.78,39.45 34.01,39.45 29.13,44.33 U$2.P98 | R8.1 39.88,38.35
!PHY_RESET  (via drill 0.25)
  Top 0.152: U$17.P5 43.44,36.32 v41.66,36.32 | v34.37,38.91 33.83,38.91 28.63,44.12 U$2.P97
  Bottom 0.152: v41.66,36.32 36.96,36.32 v34.37,38.91 31.64,38.91 R9.1
+3V3  (via drill 0.25, 0.35, 0.48)  (2 unrouted)
  Top 0.152: v42.16,47.37 42.16,47.93 IC6.4 | U$17.P6 43.53,35.81 v43.43,35.81 | U$17.P19 43.95,40.39 43.94,40.39 43.08,41.25 v43.08,41.33 | R18.2 v31.5,34.04 | R20.2 v35.31,34.04 | R17.1 v39.12,34.04 | U$2.P100 30.13,44.8 v30.99,43.94 | v15.34,46.99 15.44,47.09 U$2.P75 | U$2.P28 29.13,60.3 v28.7,59.87 | U$2.P6 31.04,49.59 v30.73,49.28 | U$2.P11 31,52.09 v30.73,51.82 | v43.18,48.26 43.43,48.01 43.43,47.1 R1.1 | U$2.P19 32.56,56.09 v33.02,55.63 | R33.1 38.84,52.48 37.57,52.48 v37.47,52.58 | IC6.4 | U$2.P50 18.13,60.28 18.54,59.87 v18.64,59.87 | C4.1 22.52,66.22 v22.5,66.2 | R8.2 v35.05,38.35
  Top 0.254: C41.1 v9.14,37.85 9.14,37.34 C6.1 | C5.1 v6.6,37.85 | v6.6,37.85 | C7.1 19.3,37.34 v19.3,37.59 20.23,38.52 C47.1 | C31.1 16.76,37.34 v16.76,37.59 17.69,38.52 C49.1 | C39.1 14.22,37.34 v14.22,37.59 15.15,38.52 C48.1 | C40.1 11.68,37.34 v11.68,37.59 12.61,38.52 C42.1
  Top 0.318: v47.27,55.58 | L1.1 46.42,56.43 v47.27,55.58
  Top 0.406: U$1.TAB 10.09,25.32 | 10.09,25.02 8.51,26.59 8.51,30.18 6.1,32.59 6.1,34.16
  Top 0.61: U$1.TAB 10.09,25.02 | 6.1,34.16 C2.2
  Bottom 0.152: v40.79,58.98 40.79,59.33 R4.2 | X1.7 4.5,57.34 4.2,57.02 v4.2,56.84 | 4.51,56.34 4.2,56.67 v4.2,56.84 | 4.71,48.84 X1.24 4.52,48.84 4.2,49.15 v4.2,49.33 | v4.2,56.84 5.56,56.84 X1.8 | 4.45,56.4 4.52,56.34 X1.9 | X1.22 4.56,49.84 4.2,49.48 v4.2,49.33 | v4.2,49.33 X1.23 | R9.2 v28.7,38.86
  other vias: 7.62,33.78 8.38,33.78 7.62,34.42 7.62,35.05 8.38,35.05 8.38,34.42 8.38,35.69 7.62,35.69 6.86,35.69 6.1,35.69 6.1,36.32 6.86,36.32 7.62,36.32 8.38,36.32
  pour Route2: -1.27,33.02 39.79,33.02 arc-90 41.5,31.31 41.5,28.2 52.07,28.2 52.07,71.12 -1.27,71.12
  pour Top: 5.59,36.58 8.64,36.58 8.64,33.53 5.59,33.53
  pour Bottom: 4.66,57.37 6.5,57.37 6.5,56.3 4.66,56.3
  pour Bottom: 4.78,49.9 6.25,49.9 6.25,48.78 4.78,48.78
+5V  (via drill 0.25)
  Top 0.152: C3.2 9.03,19.82 13.38,19.82 26.6,33.05 26.6,33.88 R10.2
  Top 0.406: U$1.P3 3.88,22.41 | U$1.P3 4.06,22.21 | 3.25,51.36 3.25,43.68 5,41.93 5,32.08 7.37,29.71 7.37,20.32 | v4.2,52.32 3.25,51.36 | 3.25,51.36 3.25,52.9 v4.2,53.85 | 7.37,20.32 C3.2 | 7.37,20.32 5.48,22.21 U$1.P3
  Top 0.61: C3.2 FUSE1.2
  Top 1.016: D2.C 5.53,14.69 FUSE1.2
  Bottom 0.152: X1.14 5.55,53.85 v4.2,53.85 | X1.17 5.55,52.32 v4.2,52.32 | X1.18 4.51,51.84 4.2,52.14 v4.2,52.32 | X1.16 4.54,52.84 4.2,52.5 v4.2,52.32 | X1.15 4.54,53.34 4.2,53.67 v4.2,53.85 | X1.13 4.51,54.34 4.2,54.03 v4.2,53.85
  pour Bottom: 4.63,54.37 6.5,54.37 6.5,51.8 4.63,51.8
ADC1_IN3  (via drill 0.25)
  Top 0.152: U$2.P26 30.14,61.52 27.34,64.31 8,64.31 v6.64,62.95
  Bottom 0.152: v6.64,62.95 6.64,60.71 6.26,60.34 X1.1
ADC2_IN6  (via drill 0.25)
  Top 0.152: U$2.P31 27.66,60.87 27.66,61.49 25.68,63.48 9.56,63.48 v9.04,62.95
  Bottom 0.152: v9.04,62.95 v9.03,62.95 8.11,62.03 8.11,60.32 6.62,58.83 5.58,58.83 X1.4
ADC2_IN8  (via drill 0.25)
  Top 0.152: U$2.P35 25.64,61.49 23.96,63.17 13.42,63.17 | 13.42,63.17 | 13.42,63.17 v11.2,60.95
  Bottom 0.152: v11.2,60.95 10.57,60.33 9.18,60.33 X1.60
ADC2_IN9  (via drill 0.25)
  Top 0.152: U$2.P36 25.14,61.47 23.74,62.87 13.91,62.87 v12,60.95
  Bottom 0.152: v12,60.95 10.87,59.82 9.19,59.82 X1.59
CAN1_RX  (via drill 0.25)
  Top 0.152: U$2.P70 13.37,49.58 v13.25,49.7
  Bottom 0.152: v13.25,49.7 13.12,49.84 X1.39
CAN1_TX  (via drill 0.25)
  Top 0.152: U$2.P71 12.89,49.09 v12.71,49.24
  Bottom 0.152: v12.71,49.24 12.62,49.33 9.18,49.33 X1.38
CAN2_RX  (via drill 0.25)
  Top 0.152: U$2.P91 25.64,44.8 23.27,42.44 9.82,42.44 v9.04,43.22
  Bottom 0.152: v9.04,43.22 8.11,44.15 8.11,45.92 6.71,47.32 5.58,47.32 X1.27
CAN2_TX  (via drill 0.25)
  Top 0.152: U$2.P92 26.11,45.32 26.11,44.78 23.47,42.14 9.32,42.14 v8.24,43.22
  Bottom 0.152: v8.24,43.22 7.65,43.81 7.65,45.79 6.61,46.84 6.57,46.84 X1.28
CLOCK_50MHZ
  Top 0.152: U$17.P13 46.4,39.28 46.4,46.38 IC6.5 42.27,50.52 42.27,51.45 34.23,59.49 31.24,59.49 30.71,58.95 | 31.34,58.59 U$2.P24 31.08,58.59 30.71,58.95 | U$2.P12 31.23,52.59 30.35,53.47 30.35,58.6 30.71,58.95
DAC_EXT9  (via drill 0.25)
  Top 0.152: U$2.P40 23.14,61.49 22.07,62.56 14.41,62.56 v12.8,60.95
  Bottom 0.152: v12.8,60.95 11.18,59.33 X1.58
DAC_OUT1  (via drill 0.25)
  Top 0.152: U$2.P29 28.64,61.52 26.12,64.03 8.52,64.03 v7.44,62.95
  Bottom 0.152: v7.44,62.95 7.16,62.67 7.16,60.55 6.45,59.84 X1.2
DAC_OUT2  (via drill 0.25)
  Top 0.152: U$2.P30 28.14,61.52 25.9,63.75 9.04,63.75 v8.24,62.95
  Bottom 0.152: v8.24,62.95 v8.23,62.95 7.65,62.37 7.65,60.46 6.53,59.33 X1.3
ETH_RD+
  Top 0.152: U$17.P8 45.29,37.06 45.29,29.21 45.29,28.96 | U$15.P6 37.85,25.65 38.95,26.76 43.43,26.76 45.29,28.61 45.29,28.96 | 45.29,28.96 45.28,28.77 45.28,28.61
ETH_RD-
  Top 0.152: U$17.P7 44.96,36.83 44.96,29.46 44.96,28.7 | 37.92,28.19 37.85,28.19 | 37.85,28.19 U$15.P8 | 37.85,28.19 38.95,27.09 43.34,27.09 44.96,28.7 | 44.96,28.7
ETH_RMII_CRS_DV  (via drill 0.25)
  Top 0.152: U$17.P20 42.72,41.05 v41.78,41.05 | U$2.P32 v27.13,57.63
  Bottom 0.152: v41.78,41.05 37.47,41.05 27.13,51.38 v27.13,57.63
ETH_RMII_MDC
  Top 0.152: U$17.P16 45.39,40.26 45.39,41.63 32.46,54.56 31.91,54.56 U$2.P16
ETH_RMII_MDIO
  Top 0.152: U$17.P15 45.72,39.88 45.72,41.73 41.95,45.5 41.95,45.58 42.23,45.86 | U$2.P25 32.7,59.09 33.62,58.17 33.62,53.82 41.6,45.86 42.23,45.86 | 42.38,46.01 R1.2 42.23,45.86
ETH_RMII_RX_D0
  Top 0.152: 44.45,40.61 42.15,42.91 40.63,42.91 R32.2
ETH_RMII_RX_D1
  Top 0.152: 44.95,40.38 44.95,40.72 R39.2
ETH_RMII_TX_D0  (1 unrouted)
  Top 0.152: 42.72,39.06 41.3,39.06 38.2,42.16 R40.2
ETH_RMII_TX_D1  (1 unrouted)
  Top 0.152: 42.52,38.56 41.2,38.56 39.17,40.59 38.47,40.59 38.01,41.06 37.18,41.88 R41.2
ETH_RMII_TX_EN
  Top 0.152: U$17.P1 42.62,38.05 41.04,38.05 38.96,40.13 35.84,40.13 35.68,40.29 R42.2
ETH_TD+
  Top 0.152: U$17.P11 46.56,37.72 46.56,25.26 41.71,20.41 38.95,20.41 37.85,19.3 U$15.P1
ETH_TD-
  Top 0.152: U$17.P10 46.23,37.54 46.23,25.4 41.57,20.74 38.95,20.74 37.85,21.84 U$15.P3
ETH_THERMAL  (4 unrouted)
GND  (via drill 0.25, 0.35, 0.38, 0.48)  (2 unrouted)
  Top 0.152: v40.39,52.45 41.2,51.64 IC6.1 | v45.76,36.96 45.76,37.3 U$17.P9 | U$17.P21 v42.82,40.23 | LED5.C v31.24,36.58 | U$2.P99 29.63,44.54 v29.97,44.2 | v14.96,47.52 15.02,47.59 U$2.P74 | U$2.P27 29.63,60.16 v29.34,59.87 | U$2.P10 31.14,51.59 v30.73,51.18 | R16.2 | R16.2 v43.18,45.39 | U$2.P20 32.82,56.59 v33.02,56.39 | C4.2 27.23,66.22 v27.25,66.2 | LED1.C v27.43,36.58
  Top 0.254: C41.2 v12.19,40.89 | C42.2 v14.73,40.89 | C48.2 v17.27,40.89 | C49.2 v19.81,40.89 | C47.2 21.43,40.23 v22.1,40.89 | C40.2 14.06,35.21 v14.99,34.29 | C39.2 | C39.2 v17.27,34.29 | C31.2 | C31.2 v19.81,34.29 | v22.1,34.04 21.43,34.7 C7.2 | C6.2 | C6.2 v12.19,34.29 | C5.2 | C5.2 v9.65,40.89
  Top 0.305: C20.2 v42.67,17.78 | C18.2 v42.67,29.97
  Top 0.318: C9.2 40.85,56.22 v41.71,55.37 | v44.5,55.52 43.65,56.38 C14.2 | v44.5,55.52
  Top 0.406: U$1.P1 4.06,26.81 | 3.81,34.16 C2.1 3.43,34.29 3.3,34.29 3.88,33.71 U$1.P1 | 3.87,26.8 U$1.P1 | U$1.P1 4.06,26.99 3.62,26.99 2.03,25.4 2.03,15.62 | D2.A 2.03,10.65 2.03,14.22 2.03,15.62 | C3.1 2.03,15.62
  Top 0.61: CN1.2 14.73,7.95
  Top 1.016: CN1.3 17.65,10.75 14.73,7.95 | CN1.2 13.97,7.11 5.57,7.11 D2.A
  Bottom 0.152: v28.21,42.25 28.21,41.92 27.85,41.56 R34.1 | v43.51,59.18 43.51,59.38 C16.2 | C13.2 17.41,45.06 v17.41,45.66 | C12.2 v18.29,66.29 | 5.54,57.81 X1.6 4.28,57.84 4.2,57.92 v4.2,58.09 4.2,58.27 4.27,58.34 X1.5 | X1.44 v10.46,52.35 | X1.26 4.27,47.84 4.2,47.9 v4.2,48.08 4.2,48.23 4.28,48.31 5.54,48.31 X1.25 | 5.56,54.84 X1.12 4.51,54.84 4.2,55.15 v4.2,55.34 | X1.10 4.52,55.84 4.2,55.52 v4.2,55.34 | X1.21 5.56,50.34 4.53,50.34 4.2,50.67 v4.2,50.84 | X1.19 | X1.19 5.56,51.34 | X1.11 4.21,55.34 v4.2,55.34 | X1.19 4.52,51.34 4.2,51.02 v4.2,50.84 | X1.20 4.21,50.84 v4.2,50.84
  Bottom 0.305: C19.2 v42.67,16.76 | C17.2 v42.67,30.99
  other vias: 1.52,33.78 2.29,33.78 2.29,34.42 2.29,35.05 1.52,35.05 1.52,34.42 1.52,35.69 2.29,35.69 3.05,35.69 3.81,35.69 1.52,36.32 2.29,36.32 3.05,36.32 3.81,36.32 46.23,16.76 47.24,16.76 48.26,16.76 48.64,15.88 45.85,16 45.76,36.07 44.49,36.07 47.03,36.07 8.13,24.64 8.13,23.37 8.13,22.1 8.13,20.83 9.4,22.1 10.67,22.1 11.94,22.1 13.21,22.1 11.94,23.37 11.94,24.64 11.94,25.91 13.21,27.18 13.21,25.91 13.21,24.64 13.21,23.37 11.94,20.83 10.67,20.83 9.4,20.83 13.21,20.83 11.94,27.18 10.67,27.18 9.4,27.18 9.4,28.45 10.67,28.45 11.94,28.45 13.21,28.45 8.13,25.91 45.76,33.53 45.76,30.99 45.76,28.45 47.03,33.53 44.49,33.53 44.49,30.99 47.03,30.99 47.03,28.45 45.76,25.91 47.03,25.91 41.91,27.56 39.37,27.56 39.37,26.29 41.91,26.29 39.37,21.21 39.37,19.94 41.91,19.94 45.76,23.62 43.22,21.08 44.74,24.64 42.2,22.1 43.98,28.45 44.92,27.51
  pour Top: 1.14,36.58 1.14,33.53 4.32,33.53 4.32,36.58
  pour Route15: 21.84,-2.54 -2.54,-2.54 -2.54,72.39 53.34,72.39 53.34,14.48 37.19,14.48 37.19,30.89 28.09,30.89 21.84,24.64
  pour Top: 45.47,17.27 48.9,17.27 48.9,15.37 45.47,15.37
  pour Bottom: 4.63,55.87 6.5,55.87 6.5,54.8 4.63,54.8
  pour Bottom: 4.8,51.37 6.25,51.37 6.25,50.33 4.8,50.33
GND_EARTH  (via drill 0.35)
  Top 0.305: v25.15,22.35 25.15,23.68 C1.2 | v25.15,25.15 25.15,23.82 C1.2 | v26.42,23.75 C1.2
  Route2 0.127: v25.15,22.35 24.89,22.1 U$16.GND1
  other vias: 46.23,11.18 48.26,11.18 48.64,12.19 45.85,12.19 47.24,11.18
  pour Route2: 26.92,13.26 26.92,24.89 26.16,25.65 24.64,25.65 23.19,24.21 23.19,13.26
  pour Route2: 52.07,13.21 23.22,13.21 23.22,-1.27 52.07,-1.27
  pour Top: 48.9,12.57 45.47,12.57 45.47,10.67 48.9,10.67
I2C1_SCL  (via drill 0.25)
  Top 0.152: U$2.P95 27.64,44.55 24.66,41.58 8.28,41.58 v6.64,43.22
  Bottom 0.152: v6.64,43.22 6.64,45.41 6.22,45.84 X1.30
I2C1_SDA  (via drill 0.25)
  Top 0.152: U$2.P93 26.64,44.8 23.69,41.86 8.8,41.86 v7.44,43.22
  Bottom 0.152: v7.44,43.22 7.42,43.25 7.16,43.48 7.16,45.68 6.51,46.33 X1.29
I2C3_SCL  (via drill 0.25)
  Top 0.152: U$2.P67 14.87,51.08 v14.75,51.2
  Bottom 0.152: v14.75,51.2 14.62,51.33 X1.42
I2C3_SDA  (via drill 0.25)
  Top 0.152: U$2.P66 15.3,51.59 v15.25,51.64 v15.24,51.64
  Bottom 0.152: v15.25,51.64 15.07,51.82 9.19,51.82 X1.43
MCU_STATUS_LED
  Top 0.152: U$2.P96 28.12,43.67 34.2,37.59 34.2,36.65 LED6.C
N$2
  Top 0.152: U$17.P4 43.48,36.93 38.44,36.93 LED4.C
N$4
  Top 0.152: U$2.P33 26.63,60.07 26.55,60 26.55,51.22 31.29,46.48 39.2,46.48 R39.1
N$6  (via drill 3.2)
  other vias: 3.81,3.81
N$7  (via drill 0.35)
  Top 0.203: U$15.P2 36.5,20.57 35.81,19.89 35.81,18.54 v36.07,18.29 36.58,17.78 C20.1
  Top 0.305: 38.67,18.29 C20.1
  Bottom 0.203: v36.07,18.29 37.59,16.76 C19.1
N$8  (via drill 0.35)
  Top 0.203: U$15.P7 36.5,26.92 35.81,27.61 35.81,28.96 v36.07,29.21 36.83,29.97 C18.1
  Bottom 0.203: v36.07,29.21 37.85,30.99 C17.1
N$9  (via drill 0.25)
  Top 0.152: U$2.P49 18.63,61.63 18.47,61.79 v18.29,61.79
  Bottom 0.152: v18.29,61.79 18.03,62.05 18.03,62.8 C12.1
N$10
  Top 0.305: R2.1 23.18,23.62 C1.1 R5.1
N$11  (via drill 0.25)
  Top 0.152: 16.98,48.09 U$2.P73 16.33,48.14 v14.91,48.14 v14.91,48.13
  Bottom 0.152: v14.91,48.13 14.76,48.13 14.46,47.83 14.46,47.25 15.31,46.4 C13.1
N$13  (1 unrouted)
  Top 0.152: U$2.P52 17.07,58.59 17.17,58.69 17.87,58.69 30.96,45.59 34.09,45.59 35.54,44.14
N$14  (1 unrouted)
N$15
  Top 0.152: LED1.A 24.64,36.06 24.64,34.46 R10.1
N$16  (1 unrouted)
  Top 0.152: U$16.P2 35.05,10.36 35.05,22.1 35.05,22.35 35.05,24.13 32,27.18 29.97,27.18 28.96,28.19
N$18  (via drill 0.25)
  Top 0.152: U$2.P94 27.13,44.68 26.49,44.04 v26.5,44.03
  Bottom 0.152: v26.5,44.03 25.92,43.45 R34.2
N$23
  Top 0.152: U$16.P1 35.92,8.08 34.52,9.47 34.51,9.47 34.51,23.91 31.75,26.67 29.97,26.67 28.96,25.65 U$15.P11
N$25
  Top 0.152: IC6.3 39.17,50.93 37.84,50.93 R33.2
N$27  (via drill 3.2)
  other vias: 46.99,3.81
N$28  (via drill 3.2)
  other vias: 3.81,66.04
N$29
  Top 1.016: FUSE1.1 10.55,9.69 CN1.1
N$30  (via drill 3.2)
  other vias: 46.99,66.04
N$37
  Top 0.152: U$2.P34 26.13,60.1 26.23,60 26.23,51.14 31.2,46.17 37.37,46.17 R32.1
N$38  (1 unrouted)
  Top 0.152: U$2.P51 17.04,59.09 17.12,59.01 17.95,59.01 31.09,45.87 34.23,45.87 35.84,44.26
N$39  (via drill 0.25)
  Top 0.152: U$2.P48 19.13,58.52 v20.4,57.25 | R42.1 34.25,41.65 v31.22,44.68
  Bottom 0.152: v31.22,44.68 20.4,55.5 v20.4,57.25
N$40  (via drill 0.25)
  Top 0.152: U$2.P57 14.5,56.09 14.27,56.32 12.8,56.32 v12.78,56.34
  Bottom 0.152: v12.78,56.34 X1.52
N$43  (1 unrouted)
  Top 0.152: U$15.P16 28.96,19.3 29.97,20.32 31.24,20.32 32,19.56 32,10.36 | U$16.P3 33.96,8.08 32.51,9.53 32.51,19.81 31.5,20.83 29.97,20.83 28.96,21.84
N$44
  Bottom 0.152: U$16.P5 33.53,9.09 U$16.P4
N$45
  Bottom 0.152: U$16.P7 29.46,9.09 U$16.P8
N$46
  Top 0.152: LED4.A 36.07,36.04 36.07,34.47 R17.2
N$47  (via drill 0.25)
  Top 0.152: U$2.P58 14.36,55.59 v14.25,55.7
  Bottom 0.152: v14.25,55.7 14.14,55.81 9.19,55.81 X1.51
N$48
  Top 0.152: LED6.A 32.25,36.04 32.25,34.47 R20.1
N$49  (via drill 0.25)
  Top 0.152: v12.55,55.33 13.87,55.33 14.11,55.09 U$2.P59
  Bottom 0.152: v12.55,55.33 X1.50
N$50  (via drill 0.25)
  Top 0.152: v13.75,54.7 13.86,54.59 U$2.P60
  Bottom 0.152: v13.75,54.7 13.61,54.84 X1.49
N$54  (via drill 0.25)
  Top 0.152: U$2.P61 13.6,54.09 13.35,54.33 v12.28,54.33
  Bottom 0.152: v12.28,54.33 X1.48
N$55  (via drill 0.25)
  Top 0.152: U$2.P62 13.36,53.59 v13.25,53.7
  Bottom 0.152: v13.25,53.7 13.12,53.83 X1.47
N$60
  Top 0.152: U$17.P14 46.04,39.49 46.04,41.94 45.2,42.78 R16.1
N$82  (via drill 0.25)
  Top 0.152: U$2.P64 16.33,52.53 13.57,52.53 12.8,53.31 v11.98,53.31
  Bottom 0.152: v11.98,53.31 11.96,53.33 X1.46
N$84  (via drill 0.25)
  Top 0.152: U$2.P65 16.33,52.14 13.39,52.14 12.7,52.84 v11.56,52.84
  Bottom 0.152: v11.56,52.84 X1.45
N$98  (via drill 0.25)
  Top 0.152: U$2.P68 16.36,50.57 14.38,50.57 v14.25,50.7
  Bottom 0.152: v14.25,50.7 14.12,50.83 9.18,50.83 X1.41
N$102  (via drill 0.25)
  Top 0.152: U$2.P69 13.82,50.09 v13.72,50.19
  Bottom 0.152: v13.72,50.19 13.56,50.34 X1.40
N$104
  Top 0.152: LED5.A 28.44,36.04 28.44,34.47 R18.1
NRST  (via drill 0.25)
  Top 0.152: U$2.P14 30.89,53.59 v30.81,53.67
  Bottom 0.152: v30.81,53.67 30.56,53.92 30.56,58.52 33.93,61.9 38.23,61.9 R4.1 38.8,61.89 41,61.89 C16.1 41.53,62.37 41.53,63.63 CN2.5
RXCT
  Top 0.305: U$15.P15 R2.2
SPI2_MISO  (via drill 0.25)
  Top 0.152: U$2.P53 15.34,58.09 15.08,58.34 v13,58.34
  Bottom 0.152: v13,58.34 X1.56
SPI2_MOSI  (via drill 0.25)
  Top 0.152: v14.93,57.84 15.18,57.59 U$2.P54
  Bottom 0.152: v14.93,57.84 X1.55 | X1.55
SPI2_SCK  (via drill 0.25)
  Top 0.152: U$2.P47 19.64,61.55 18.93,62.26 14.9,62.26 v13.6,60.95
  Bottom 0.152: v13.6,60.95 11.48,58.83 9.18,58.83 X1.57
SPI3_MISO  (via drill 0.25)
  Top 0.152: U$2.P90 25.14,44.8 23.11,42.77 13.65,42.77 v11.21,45.22 v11.2,45.22
  Bottom 0.152: v11.2,45.22 10.6,45.82 9.18,45.82 X1.31
SPI3_MOSI  (via drill 0.25)
  Top 0.152: U$2.P80 20.11,45.32 20.11,44.78 18.7,43.37 14.63,43.37 v12.79,45.2 v12.8,45.2
  Bottom 0.152: v12.8,45.2 11.11,46.84 X1.33
SPI3_SCK  (via drill 0.25)
  Top 0.152: U$2.P89 24.61,45.32 24.61,44.78 22.88,43.05 14.15,43.05 12,45.2 v12,45.22
  Bottom 0.152: v12,45.22 10.89,46.33 X1.32
SWD_SWCLK  (via drill 0.25)
  Top 0.152: v18.14,46.36 v18.13,46.35 U$2.P76
  Bottom 0.152: v18.14,46.36 18.36,46.59 18.36,56.23 20.88,58.75 30.18,58.75 33.79,62.36 37.05,62.36 38.35,63.66 CN2.3
SWD_SWDIO  (via drill 0.25)
  Top 0.152: U$2.P72 17.09,48.59 17.6,49.1 v17.6,52.14 v17.6,52.15
  Bottom 0.152: v17.6,52.15 17.6,53.05 17.96,53.42 17.96,56.39 20.65,59.08 29.99,59.08 33.71,62.8 36.13,62.8 37.08,63.75 37.08,65.53 CN2.4
SWD_SWO  (via drill 0.25)
  Top 0.152: U$2.P63 17.04,53.09 17.53,53.57 v17.53,54.61
  Bottom 0.152: v17.53,54.61 17.53,56.53 20.43,59.44 29.82,59.44 34.29,63.91 34.29,67.31 35.31,68.33 39.37,68.33 CN2.6
TXCT
  Top 0.305: U$15.P10 R5.2
UART4_RX  (via drill 0.25)
  Top 0.152: U$2.P79 19.64,44.8 18.55,43.72 14.93,43.72 11.32,47.33 11.2,47.33 v11.18,47.3
  Bottom 0.152: v11.18,47.3 11.14,47.34 X1.34 10.22,47.34
UART4_TX  (via drill 0.25)
  Top 0.152: U$2.P78 19.11,45.32 19.11,44.78 18.4,44.07 15.2,44.07 11.5,47.77 v11.5,47.79
  Bottom 0.152: v11.5,47.79 11.46,47.84 X1.35 10.21,47.84
USART2_RX  (via drill 0.25, 0.35)
  Top 0.152: v12.24,48.74 14.51,46.48 17.13,46.48 17.73,47.08 22.52,47.08 23.64,45.96 U$2.P87 23.63,44.79 23.36,44.52 v23.36,44.21
  Bottom 0.152: v12.24,48.74 12.17,48.82 9.18,48.82 X1.37
USART2_TX  (via drill 0.25, 0.35)
  Top 0.152: v11.86,48.26 13.92,46.2 17.3,46.2 17.9,46.8 22.4,46.8 23.13,46.07 U$2.P86 23.13,44.78 22.85,44.5 22.85,43.78 v22.84,43.76
  Bottom 0.152: v11.86,48.26 11.79,48.34 X1.36 | X1.36 | v22.84,43.76 22.84,43.76 22.85,43.76
USART3_RX  (via drill 0.25)
  Top 0.152: U$2.P56 14.61,56.59 v14.5,56.7
  Bottom 0.152: v14.5,56.7 14.37,56.83 9.17,56.83 X1.53
USART3_TX  (via drill 0.25)
  Top 0.152: U$2.P55 14.86,57.09 v14.65,57.3
  Bottom 0.152: v14.65,57.3 14.62,57.33 9.17,57.33 X1.54
VDDA_FILTERED  (via drill 0.32)
  Top 0.152: U$2.P22 32.81,57.59 32.99,57.4 v32.99,57.35 32.99,57.25 32.83,57.09 U$2.P21
  Top 0.318: v37.59,57.4 39.3,57.4 C9.1 42.1,57.57 C14.1 44.95,57.72 L1.2
  Bottom 0.254: v32.99,57.35 37.54,57.35 v37.59,57.4

### Text on the board
tNames: 5v | 3v3 | MCU | PHY | LaTAR Base B0